# EAGLE design 16ch_omn_hirose_adapter (EAGLE 7.2.0)
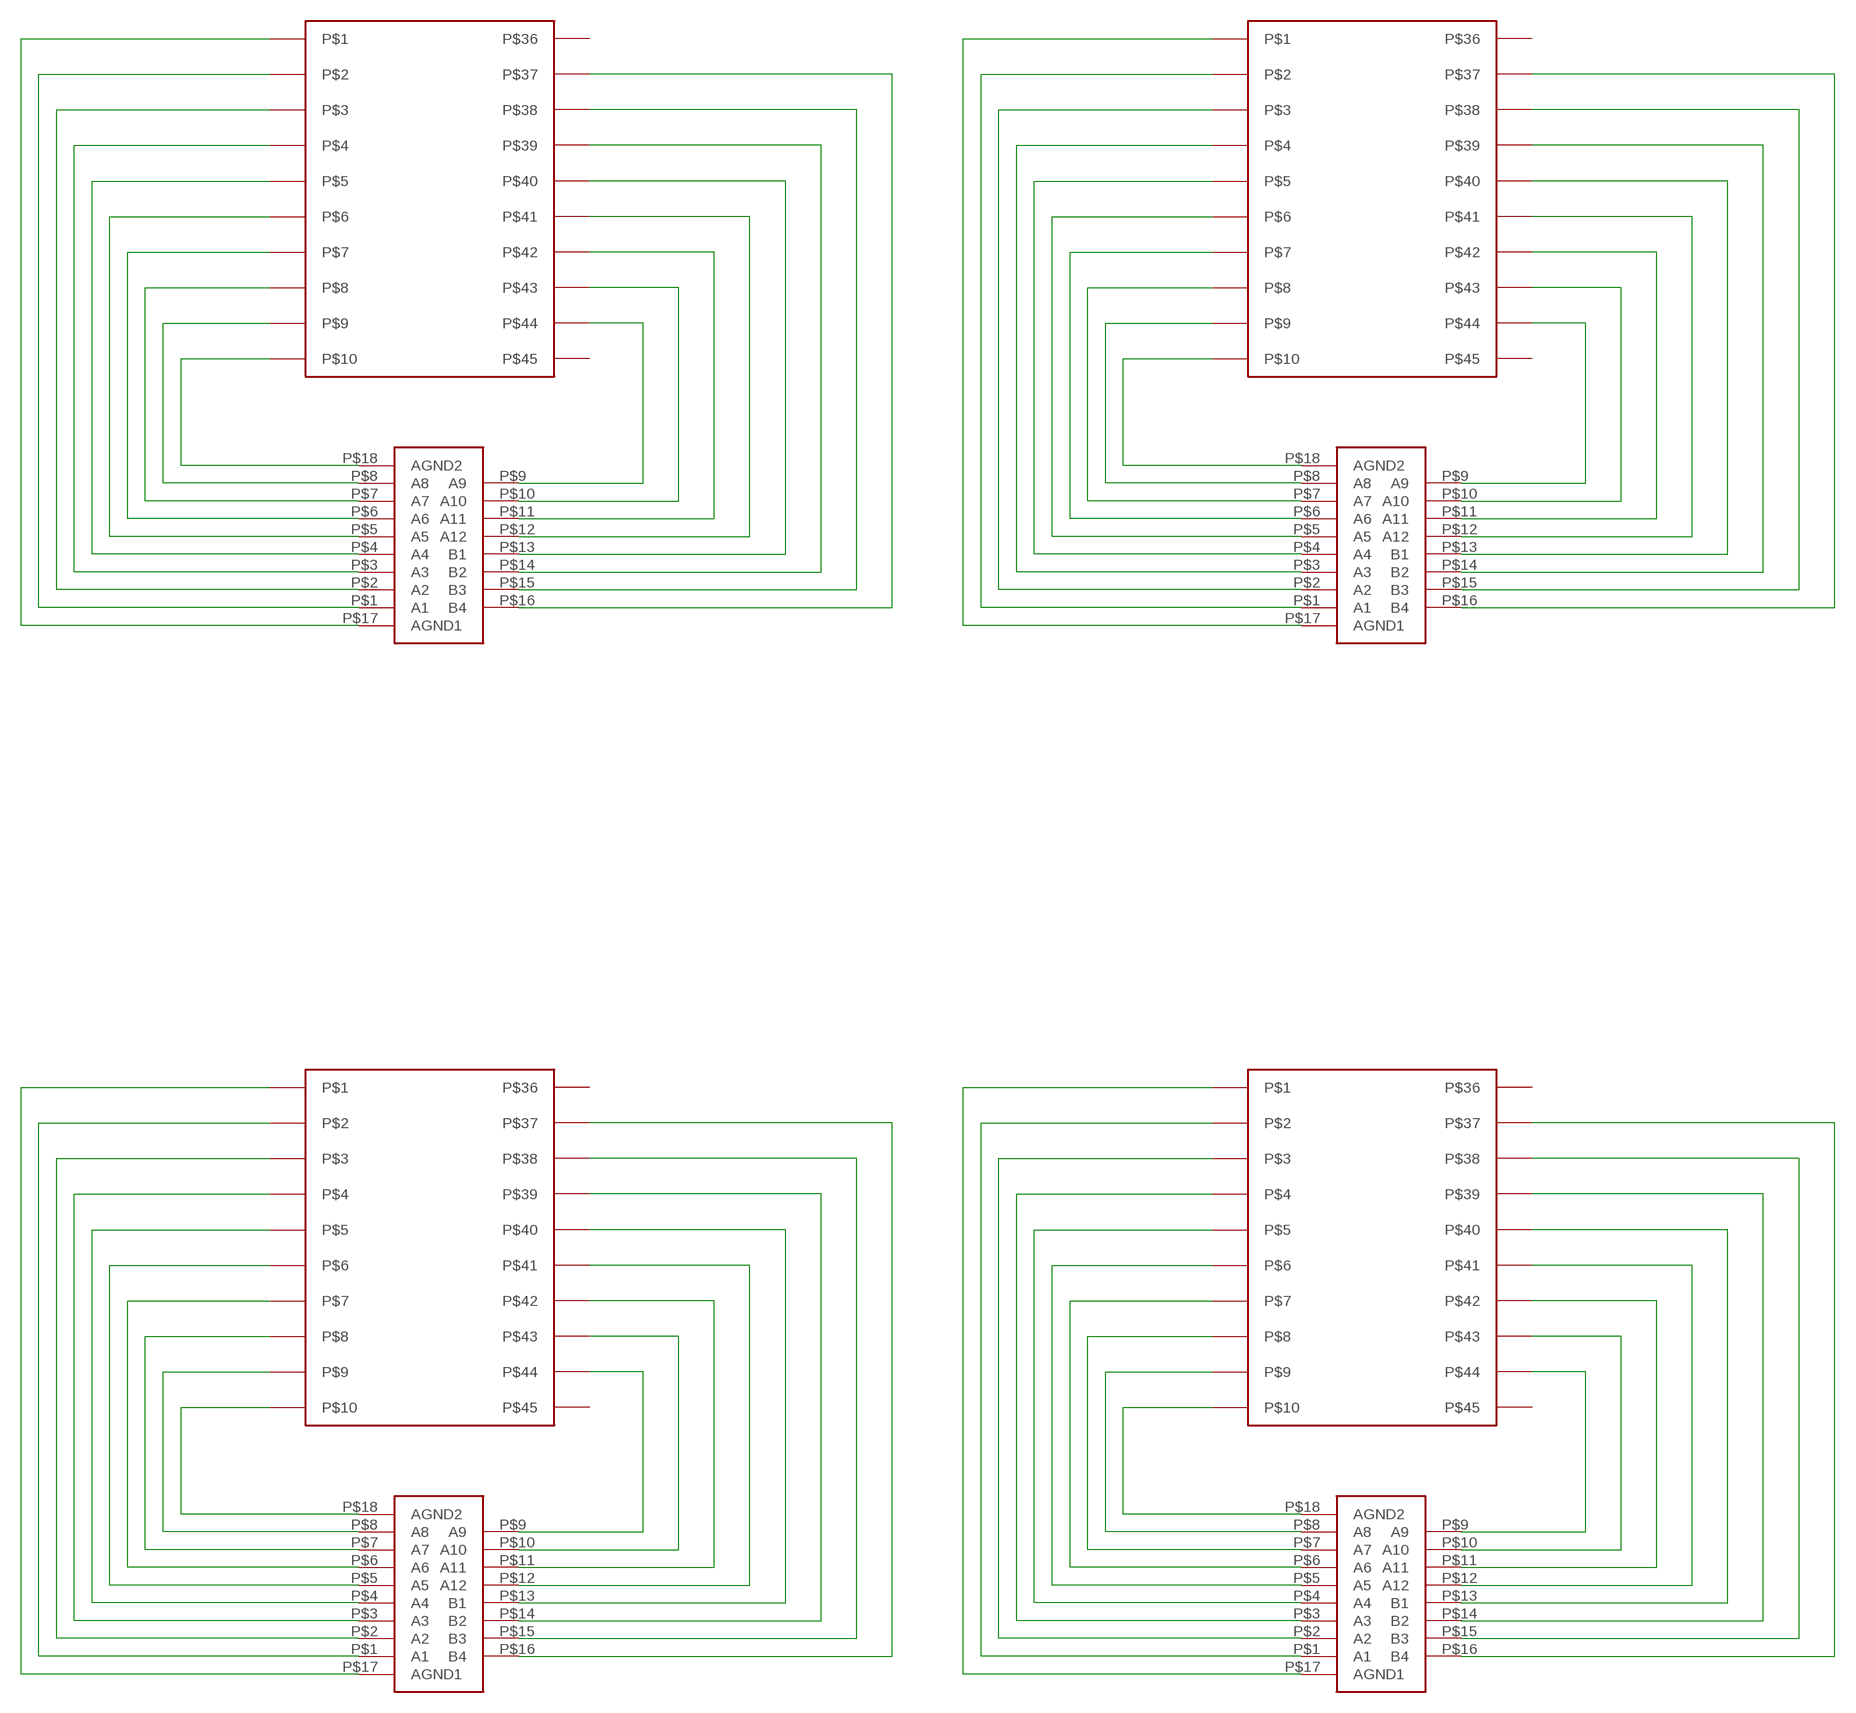
[diagram p0: schematic, sheet 1]

## Parts
U$1  HIROSE_DF40_70PIN  [HIROSE_DF40C-70DS]
U$2  OMNETICS_FE18  [OMNETICS_FE18]
U$3  HIROSE_DF40_70PIN  [HIROSE_DF40C-70DS]
U$4  OMNETICS_FE18  [OMNETICS_FE18]
U$5  HIROSE_DF40_70PIN  [HIROSE_DF40C-70DS]
U$6  OMNETICS_FE18  [OMNETICS_FE18]
U$7  HIROSE_DF40_70PIN  [HIROSE_DF40C-70DS]
U$8  OMNETICS_FE18  [OMNETICS_FE18]

## Nets
N$1: U$1.P$10 U$2.P$18(AGND2)
N$2: U$1.P$9 U$2.P$8(A8)
N$3: U$1.P$8 U$2.P$7(A7)
N$4: U$1.P$7 U$2.P$6(A6)
N$5: U$1.P$6 U$2.P$5(A5)
N$6: U$1.P$5 U$2.P$4(A4)
N$7: U$1.P$4 U$2.P$3(A3)
N$8: U$1.P$3 U$2.P$2(A2)
N$9: U$1.P$2 U$2.P$1(A1)
N$10: U$1.P$1 U$2.P$17(AGND1)
N$11: U$1.P$44 U$2.P$9(A9)
N$12: U$1.P$43 U$2.P$10(A10)
N$13: U$1.P$42 U$2.P$11(A11)
N$14: U$1.P$41 U$2.P$12(A12)
N$15: U$1.P$40 U$2.P$13(B1)
N$16: U$1.P$39 U$2.P$14(B2)
N$17: U$1.P$38 U$2.P$15(B3)
N$18: U$1.P$37 U$2.P$16(B4)
N$19: U$3.P$10 U$4.P$18(AGND2)
N$20: U$3.P$9 U$4.P$8(A8)
N$21: U$3.P$8 U$4.P$7(A7)
N$22: U$3.P$7 U$4.P$6(A6)
N$23: U$3.P$6 U$4.P$5(A5)
N$24: U$3.P$5 U$4.P$4(A4)
N$25: U$3.P$4 U$4.P$3(A3)
N$26: U$3.P$3 U$4.P$2(A2)
N$27: U$3.P$2 U$4.P$1(A1)
N$28: U$3.P$1 U$4.P$17(AGND1)
N$29: U$3.P$44 U$4.P$9(A9)
N$30: U$3.P$43 U$4.P$10(A10)
N$31: U$3.P$42 U$4.P$11(A11)
N$32: U$3.P$41 U$4.P$12(A12)
N$33: U$3.P$40 U$4.P$13(B1)
N$34: U$3.P$39 U$4.P$14(B2)
N$35: U$3.P$38 U$4.P$15(B3)
N$36: U$3.P$37 U$4.P$16(B4)
N$37: U$5.P$10 U$6.P$18(AGND2)
N$38: U$5.P$9 U$6.P$8(A8)
N$39: U$5.P$8 U$6.P$7(A7)
N$40: U$5.P$7 U$6.P$6(A6)
N$41: U$5.P$6 U$6.P$5(A5)
N$42: U$5.P$5 U$6.P$4(A4)
N$43: U$5.P$4 U$6.P$3(A3)
N$44: U$5.P$3 U$6.P$2(A2)
N$45: U$5.P$2 U$6.P$1(A1)
N$46: U$5.P$1 U$6.P$17(AGND1)
N$47: U$5.P$44 U$6.P$9(A9)
N$48: U$5.P$43 U$6.P$10(A10)
N$49: U$5.P$42 U$6.P$11(A11)
N$50: U$5.P$41 U$6.P$12(A12)
N$51: U$5.P$40 U$6.P$13(B1)
N$52: U$5.P$39 U$6.P$14(B2)
N$53: U$5.P$38 U$6.P$15(B3)
N$54: U$5.P$37 U$6.P$16(B4)
N$55: U$7.P$10 U$8.P$18(AGND2)
N$56: U$7.P$9 U$8.P$8(A8)
N$57: U$7.P$8 U$8.P$7(A7)
N$58: U$7.P$7 U$8.P$6(A6)
N$59: U$7.P$6 U$8.P$5(A5)
N$60: U$7.P$5 U$8.P$4(A4)
N$61: U$7.P$4 U$8.P$3(A3)
N$62: U$7.P$3 U$8.P$2(A2)
N$63: U$7.P$2 U$8.P$1(A1)
N$64: U$7.P$1 U$8.P$17(AGND1)
N$65: U$7.P$44 U$8.P$9(A9)
N$66: U$7.P$43 U$8.P$10(A10)
N$67: U$7.P$42 U$8.P$11(A11)
N$68: U$7.P$41 U$8.P$12(A12)
N$69: U$7.P$40 U$8.P$13(B1)
N$70: U$7.P$39 U$8.P$14(B2)
N$71: U$7.P$38 U$8.P$15(B3)
N$72: U$7.P$37 U$8.P$16(B4)
Unconnected: U$1.P$36 U$1.P$45 U$3.P$36 U$3.P$45 U$5.P$36 U$5.P$45 U$7.P$36 U$7.P$45

## Library data of the parts
U$1 U$3 U$5 U$7 = GG_hirose20:HIROSE_DF40_70PIN
U$2 U$4 U$6 U$8 = connectors:OMNETICS_FE18

## Board
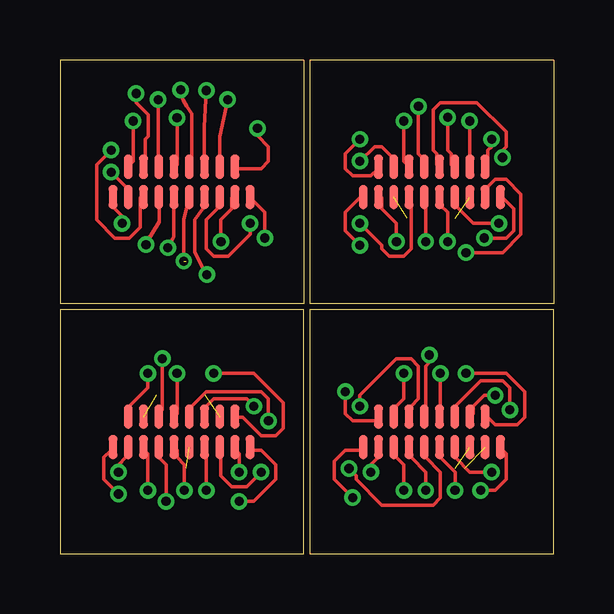
[diagram p1: board, top side]
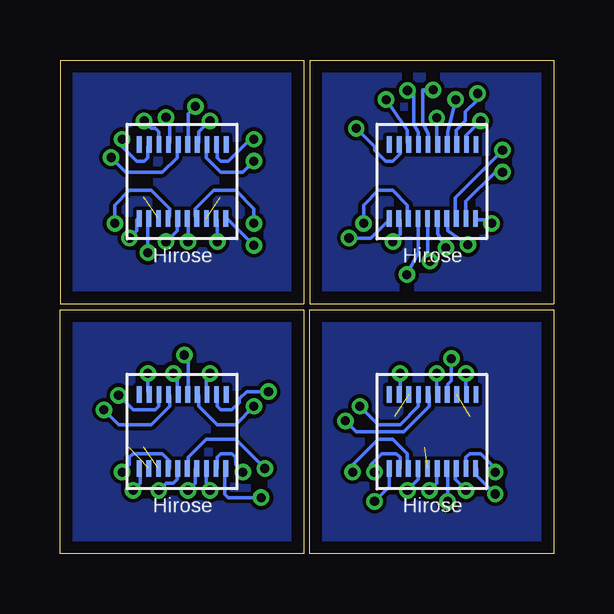
[diagram p2: board, bottom side, seen from below]

Size 20.57 x 20.57 mm. Coordinates in mm from the lower left corner, seen from the top.
Outline: 0,0 10.16,0 10.16,10.16 0,10.16 0,0
Outline: 10.41,10.16 10.41,0 20.57,0 20.57,10.16 10.41,10.16
Outline: 10.16,10.41 0,10.41 0,20.57 10.16,20.57 10.16,10.41
Outline: 10.41,20.57 10.41,10.41 20.57,10.41 20.57,20.57 10.41,20.57
Copper layers (1*16): Top 0.035mm / dielectric 1.5mm / Bottom 0.035mm
Design rules "4pcb_33_gg *": minimum track width 6mil, minimum drill 15mil, track to track 6mil, track to pad 6mil, pad to pad 6mil, via to via 6mil, smd to smd 6mil, copper to edge 20mil, drill to drill 6mil, minimum pad ring 6mil, minimum via ring 6mil, stop-mask expansion 4mil, vias tented up to drill 0mil, thermal gap 10mil

### Footprints (pad centres in the part's own frame; a part is rotated, then mirrored left to right if it is on the bottom)
HIROSE_DF40C-70DS = smd 0.2 x 0.7: P$1 0,0; P$2 -0.4,0; P$3 -0.8,0; P$4 -1.2,0; P$5 -1.6,0; P$6 -2,0; P$7 -2.4,0; P$8 -2.8,0; P$9 -3.2,0; P$10 -3.6,0; P$36 0,-3.08; P$37 -0.42,-3.08; P$38 -0.82,-3.08; P$39 -1.22,-3.08; P$40 -1.62,-3.08; P$41 -2.02,-3.08; P$42 -2.42,-3.08; P$43 -2.82,-3.08; P$44 -3.22,-3.08; P$45 -3.62,-3.08
OMNETICS_FE18 = smd 0.381 x 1.016: P$1 -1.905,0.635; P$2 -1.27,0.635; P$3 -0.635,0.635; P$4 0,0.635; P$5 0.635,0.635; P$6 1.27,0.635; P$7 1.905,0.635; P$8 2.54,0.635; P$9 2.54,-0.635; P$10 1.905,-0.635; P$11 1.27,-0.635; P$12 0.635,-0.635; P$13 0,-0.635; P$14 -0.635,-0.635; P$15 -1.27,-0.635; P$16 -1.905,-0.635; P$17 -2.54,0.635; P$18 3.175,0.635

### Placement (x,y rotation side)
U$1  6.86,3.56 180 bottom
U$2  5.38,5.08 180 top
U$3  17.27,3.56 180 bottom
U$4  15.81,5.08 180 top
U$5  17.27,13.97 180 bottom
U$6  15.81,15.49 180 top
U$7  6.86,13.97 180 bottom
U$8  5.38,15.49 180 top

### Tracks (layer width: path | path; a pad name or v marks a point on that pad's centre or on a via)
N$1  (via drill 0.38)
  Top 0.152: v2.44,2.49 1.83,3.1 1.83,4.01 2.13,4.32 U$2.P$18
  Bottom 0.152: v2.44,2.49 3.2,3.25 3.2,3.56 U$1.P$10
N$2  (via drill 0.38)
  Top 0.152: v2.44,3.4 2.44,3.71 2.74,4.01 2.74,4.32 U$2.P$8
  Bottom 0.152: U$1.P$9 3.66,4.01 3.51,4.17 3.05,4.17 2.44,3.56 v2.44,3.4 | U$1.P$9
N$3  (via drill 0.38)
  Top 0.152: v3.66,2.64 3.66,4.17 3.51,4.32 U$2.P$7
  Bottom 0.152: v3.66,2.64 4.12,3.1 4.12,3.56 U$1.P$8
N$4  (via drill 0.38)
  Top 0.152: v4.42,2.18 4.42,3.71 4.12,4.01 U$2.P$6
  Bottom 0.152: v4.42,2.18 4.42,3.56 U$1.P$7
N$5  (via drill 0.38)
  Top 0.152: v5.18,2.64 5.18,3.71 4.88,4.01 4.88,4.32 U$2.P$5
  Bottom 0.152: v5.18,2.64 4.88,2.95 4.88,3.56 U$1.P$6
N$6  (1 unrouted)
N$7  (via drill 0.38)
  Top 0.152: v6.1,2.64 6.1,4.32 U$2.P$3
  Bottom 0.152: v6.1,2.64 5.64,3.1 5.64,3.56 U$1.P$4
N$8  (via drill 0.38)
  Top 0.152: v8.38,3.4 7.77,2.79 7.16,2.79 6.71,3.25 6.71,4.32 U$2.P$2
  Bottom 0.152: v8.38,3.4 8.38,3.71 7.32,4.77 6.71,4.77 6.1,4.17 6.1,3.56 U$1.P$3
N$9  (via drill 0.38)
  Top 0.152: v7.47,3.4 7.47,4.17 7.32,4.32 U$2.P$1
  Bottom 0.152: v7.47,3.4 7.62,3.56 7.62,3.71 7.16,4.17 6.55,4.17 6.4,4.01 6.4,3.56 U$1.P$2
N$10  (via drill 0.38)
  Top 0.152: v7.47,2.18 8.08,2.18 8.99,3.1 8.99,3.71 8.38,4.32 7.93,4.32 U$2.P$17
  Bottom 0.152: U$1.P$1 6.86,2.79 v7.47,2.18
N$11  (via drill 0.38)
  Top 0.152: v3.66,7.52 3.66,6.91 2.9,6.15 2.9,5.84 U$2.P$9
  Bottom 0.152: v3.66,7.52 3.66,6.76 U$1.P$44
N$12  (1 unrouted)
N$13  (via drill 0.38)
  Top 0.152: v4.27,8.13 4.27,5.99 4.12,5.84 U$2.P$11
  Bottom 0.152: v4.27,8.13 4.27,7.21 4.42,7.06 4.42,6.76 U$1.P$42
N$14  (via drill 0.38)
  Top 0.152: v4.88,7.52 4.88,5.84 U$2.P$12
  Bottom 0.152: v4.88,7.52 4.88,6.76 U$1.P$41
N$15  (via drill 0.38)
  Top 0.152: v8.69,5.54 8.69,6.45 8.38,6.76 6.1,6.76 5.49,6.15 5.49,5.84 U$2.P$13
  Bottom 0.152: v8.69,5.54 8.23,5.08 6.25,5.08 5.18,6.15 5.18,6.6 U$1.P$40
N$16  (via drill 0.38)
  Top 0.152: v8.08,6.15 7.77,6.45 6.4,6.45 6.1,6.15 6.1,5.84 U$2.P$14
  Bottom 0.152: v8.08,6.15 7.32,5.38 6.4,5.38 5.64,6.15 5.64,6.6 U$1.P$39
N$17  (1 unrouted)
N$18  (via drill 0.38)
  Top 0.152: v6.4,7.52 8.08,7.52 9.3,6.3 9.3,5.23 8.99,4.93 8.38,4.93 7.62,5.69 7.32,5.69 U$2.P$16
  Bottom 0.152: v6.4,7.52 6.4,6.76 U$1.P$37
N$19  (via drill 0.38)
  Top 0.152: v12.19,2.34 11.43,3.1 11.43,3.86 11.89,4.32 12.5,4.32 U$4.P$18
  Bottom 0.152: v12.19,2.34 13.56,2.34 13.72,2.49 13.72,3.56 U$3.P$10
N$20  (via drill 0.38)
  Top 0.152: v12.95,3.4 12.95,3.71 13.26,4.01 13.26,4.32 U$4.P$8
  Bottom 0.152: v12.95,3.4 13.26,3.71 13.26,4.01 13.41,4.17 13.87,4.17 14.02,4.01 14.02,3.56 U$3.P$9
N$21  (via drill 0.38)
  Top 0.152: v14.33,2.64 14.33,3.71 14.02,4.01 14.02,4.32 U$4.P$7
  Bottom 0.152: v14.33,2.64 14.48,2.79 U$3.P$8
N$22  (via drill 0.38)
  Top 0.152: v15.24,2.64 15.24,3.4 14.63,4.01 14.63,4.32 U$4.P$6
  Bottom 0.152: v15.24,2.64 14.94,2.95 14.94,3.56 U$3.P$7
N$23  (via drill 0.38)
  Top 0.152: v12.04,3.56 12.34,3.25 12.34,3.1 13.41,2.03 15.55,2.03 15.85,2.34 15.85,3.4 15.24,4.01 15.24,4.32 U$4.P$5
  Bottom 0.152: v12.04,3.56 13.26,4.77 14.48,4.77 15.24,4.01 15.24,3.56 U$3.P$6
N$24  (via drill 0.38)
  Top 0.152: v16.46,2.64 16.46,3.4 15.85,4.01 15.85,4.32 U$4.P$4
  Bottom 0.152: v16.46,2.64 16.15,2.95 15.85,2.95 15.7,3.1 15.7,3.56 U$3.P$5
N$25  (via drill 0.38)
  Top 0.152: v17.98,3.4 17.07,3.4 16.46,4.01 16.46,4.32 U$4.P$3
  Bottom 0.152: v17.98,3.4 17.68,3.71 17.68,4.01 17.53,4.17 16.31,4.17 16,3.86 16,3.56 U$3.P$4
N$26  (1 unrouted)
N$27  (1 unrouted)
N$28  (via drill 0.38)
  Top 0.152: v17.53,2.64 18.14,2.64 18.59,3.1 18.59,4.17 18.44,4.32 U$4.P$17
  Bottom 0.152: v17.53,2.64 17.22,2.95 17.22,3.56 U$3.P$1
N$29  (via drill 0.38)
  Top 0.152: v11.89,6.76 11.89,5.84 12.19,5.54 13.11,5.54 13.26,5.69 U$4.P$9
  Bottom 0.152: v11.89,6.76 12.8,6.76 13.11,6.45 13.11,6.3 13.41,5.99 13.87,5.99 14.02,6.15 14.02,6.6 U$3.P$44
N$30  (via drill 0.38)
  Top 0.152: v14.33,7.52 14.33,6.45 14.02,6.15 14.02,5.84 U$4.P$10
  Bottom 0.152: v14.33,7.52 14.48,7.37 14.48,6.76 U$3.P$43
N$31  (via drill 0.38)
  Top 0.152: v12.5,6.15 12.5,6.6 14.02,8.13 14.63,8.13 14.94,7.82 14.94,6.45 14.63,6.15 14.63,5.84 U$4.P$11
  Bottom 0.152: v12.5,6.15 13.26,5.38 14.02,5.38 14.78,6.15 14.78,6.6 U$3.P$42
N$32  (via drill 0.38)
  Top 0.152: v15.39,8.28 15.39,7.98 15.24,7.82 15.24,5.84 U$4.P$12
  Bottom 0.152: v15.39,8.28 15.24,8.13 15.24,6.76 U$3.P$41
N$33  (via drill 0.38)
  Top 0.152: v15.85,7.52 15.85,5.84 U$4.P$13
  Bottom 0.152: v15.85,7.52 15.7,7.37 15.7,6.76 U$3.P$40
N$34  (via drill 0.38)
  Top 0.152: v18.74,5.99 18.74,6.91 18.44,7.21 17.53,7.21 16.46,6.15 16.46,5.84 U$4.P$14
  Bottom 0.152: v18.74,5.99 18.14,5.38 16.76,5.38 16,6.15 16,6.6 U$3.P$39
N$35  (via drill 0.38)
  Top 0.152: v18.14,6.6 17.68,6.6 17.22,6.15 17.22,5.84 U$4.P$15
  Bottom 0.152: v18.14,6.6 17.53,5.99 16.61,5.99 16.46,6.15 16.46,6.6 U$3.P$38
N$36  (via drill 0.38)
  Top 0.152: v16.92,7.52 18.59,7.52 19.35,6.76 19.35,5.69 19.05,5.38 18.14,5.38 17.83,5.69 U$4.P$16
  Bottom 0.152: v16.92,7.52 16.92,6.76 U$3.P$37
N$37  (via drill 0.38)
  Top 0.152: v12.5,12.85 11.89,13.46 11.89,14.22 12.5,14.83 U$6.P$18
  Bottom 0.152: v12.5,12.85 13.72,14.07 U$5.P$10
N$38  (via drill 0.38)
  Top 0.152: v14.02,13 14.02,13.77 13.41,14.38 13.41,14.83 U$6.P$8
  Bottom 0.152: v14.02,13 14.02,13.92 U$5.P$9
N$39  (1 unrouted)
N$40  (via drill 0.38)
  Top 0.152: v12.5,13.77 13.41,12.85 13.41,12.7 13.72,12.39 14.33,12.39 14.63,12.7 14.63,14.83 U$6.P$6
  Bottom 0.152: v12.5,13.77 12.5,14.38 13.26,15.14 14.17,15.14 14.94,14.38 14.94,14.07 U$5.P$7
N$41  (via drill 0.38)
  Top 0.152: v15.24,13 15.24,14.83 U$6.P$5
  Bottom 0.152: v15.24,13 15.24,13.92 U$5.P$6
N$42  (via drill 0.38)
  Top 0.152: v16.15,13 16.15,14.22 15.85,14.53 15.85,14.83 U$6.P$4
  Bottom 0.152: v16.15,13 15.7,13.46 15.7,13.92 U$5.P$5
N$43  (via drill 0.38)
  Top 0.152: v18.29,13.77 17.22,13.77 16.46,14.53 16.46,14.83 U$6.P$3
  Bottom 0.152: v18.29,13.77 18.29,14.53 17.68,15.14 16.76,15.14 16,14.38 16,14.07 U$5.P$4
N$44  (1 unrouted)
N$45  (via drill 0.38)
  Top 0.152: v16.92,12.55 18.44,12.55 19.2,13.31 19.2,14.99 18.59,15.6 18.14,15.6 17.83,15.29 17.83,14.99 U$6.P$1
  Bottom 0.152: v16.92,12.55 16.92,13.92 U$5.P$2
N$46  (via drill 0.38)
  Top 0.152: v17.68,13.16 18.59,13.16 18.9,13.46 18.9,14.38 18.44,14.83 U$6.P$17
  Bottom 0.152: v17.68,13.16 17.37,13.46 17.37,13.92 17.22,14.07 U$5.P$1
N$47  (via drill 0.38)
  Top 0.152: v12.5,17.27 11.89,16.66 11.89,16.05 12.19,15.75 12.95,15.75 13.26,16.05 U$6.P$9
  Bottom 0.152: v12.5,17.27 12.65,17.27 13.56,16.36 13.87,16.36 14.02,16.51 14.02,16.97 U$5.P$44
N$48  (via drill 0.38)
  Top 0.152: v12.5,16.36 13.11,16.97 13.41,16.97 13.87,16.51 13.87,16.2 U$6.P$10
  Bottom 0.152: v12.5,16.36 12.95,15.9 13.87,15.9 14.48,16.51 14.48,16.97 U$5.P$43
N$49  (via drill 0.38)
  Top 0.152: v14.33,18.03 14.33,16.36 14.48,16.2 U$6.P$11
  Bottom 0.152: v14.33,18.03 14.78,17.58 14.78,17.12 U$5.P$42
N$50  (via drill 0.38)
  Top 0.152: v14.94,18.64 14.94,16.66 15.09,16.51 15.09,16.2 U$6.P$12
  Bottom 0.152: v14.94,18.64 15.24,18.34 15.24,17.12 U$5.P$41
N$51  (via drill 0.38)
  Top 0.152: v18.44,16.51 18.44,16.81 18.59,16.97 18.59,17.58 17.37,18.8 15.85,18.8 15.55,18.49 15.55,16.81 15.7,16.66 15.7,16.2 U$6.P$13
  Bottom 0.152: v18.44,16.51 17.83,15.9 16.31,15.9 15.7,16.51 15.7,16.97 U$5.P$40
N$52  (via drill 0.38)
  Top 0.152: v16.15,18.19 16.15,16.81 16.31,16.66 16.31,16.2 U$6.P$14
  Bottom 0.152: v16.15,18.19 16,18.03 16,17.12 U$5.P$39
N$53  (via drill 0.38)
  Top 0.152: v17.07,18.03 17.07,16.2 U$6.P$15
  Bottom 0.152: v17.07,18.03 16.76,17.73 16.61,17.73 16.46,17.58 16.46,17.12 U$5.P$38
N$54  (via drill 0.38)
  Top 0.152: v17.98,17.27 17.98,16.97 17.83,16.81 17.83,16.2 U$6.P$16
  Bottom 0.152: v17.98,17.27 17.98,16.97 17.37,16.36 17.07,16.36 16.92,16.51 16.92,16.97 U$5.P$37
N$55  (via drill 0.38)
  Top 0.152: v2.59,13.77 2.59,14.07 2.29,14.38 2.29,14.83 U$8.P$18
  Bottom 0.152: v2.59,13.77 2.74,13.92 3.2,13.92 U$7.P$10
N$56  (via drill 0.38)
  Top 0.152: v2.13,15.9 2.74,15.29 2.74,14.99 U$8.P$8
  Bottom 0.152: v2.13,15.9 2.44,15.9 3.66,14.68 3.66,14.07 U$7.P$9
N$57  (via drill 0.38)
  Top 0.152: v2.13,16.81 1.52,16.2 1.52,13.92 2.29,13.16 2.9,13.16 3.35,13.61 3.35,14.83 U$8.P$7
  Bottom 0.152: v2.13,16.81 4.12,14.83 4.12,14.07 U$7.P$8
N$58  (via drill 0.38)
  Top 0.152: v3.58,12.88 3.56,12.88 4.14,13.84 4.14,14.68 4.12,14.83 U$8.P$6
  Bottom 0.152: v3.58,12.88 4.42,13.46 4.42,13.92 U$7.P$7
N$59  (via drill 0.38)
  Top 0.152: U$8.P$5 4.75,13.21 4.7,13.13 v4.5,12.75
  Bottom 0.152: v4.5,12.75 4.83,13.34 4.83,13.92 4.88,13.92 U$7.P$6
N$60  (via drill 0.38 pad 0.41)  (1 unrouted)
  Top 0.152: U$8.P$4 5.16,13.92 v5.16,12.19
  Bottom 0.152: U$7.P$5 5.26,13.92 5.26,12.19
N$61  (via drill 0.38)
  Top 0.152: v6.12,11.63 6.1,11.63 5.61,12.57 5.61,13.92 5.94,14.38 5.94,14.83 U$8.P$3
  Bottom 0.152: v6.12,11.63 5.64,12.55 5.64,13.92 U$7.P$4
N$62  (via drill 0.38)
  Top 0.152: v7.93,13.77 7.93,13.31 7.01,12.39 6.4,12.39 6.1,12.7 6.1,13.92 6.55,14.38 6.55,14.83 U$8.P$2
  Bottom 0.152: v7.93,13.77 7.93,14.53 7.32,15.14 6.71,15.14 6.1,14.53 6.1,14.07 U$7.P$3
N$63  (via drill 0.38)
  Top 0.152: v6.71,13 6.71,13.92 7.16,14.38 7.16,14.83 U$8.P$1
  Bottom 0.152: v6.71,13 6.4,13.31 6.4,13.92 U$7.P$2
N$64  (via drill 0.38)
  Top 0.152: v8.53,13.16 8.53,14.22 7.93,14.83 U$8.P$17
  Bottom 0.152: v8.53,13.16 7.62,13.16 6.86,13.92 U$7.P$1
N$65  (via drill 0.38)
  Top 0.152: v3.05,18.03 3.05,16.36 2.9,16.2 U$8.P$9
  Bottom 0.152: v3.05,18.03 3.66,17.42 3.66,17.12 U$7.P$44
N$66  (via drill 0.38 pad 0.41)
  Top 0.152: U$8.P$10 3.56,16.2 3.56,17.27 3.68,17.4 3.68,18.29 3.18,18.8 v3.18,19.18
  Bottom 0.152: U$7.P$43 4.06,17.05 4.06,17.65 3.68,18.03 3.68,18.41 3.18,18.92 v3.18,19.18
N$67  (via drill 0.38)
  Top 0.152: v4.09,18.92 4.09,16.36 4.12,16.2 U$8.P$11
  Bottom 0.152: v4.09,18.92 4.42,17.58 4.42,17.12 U$7.P$42
N$68  (via drill 0.38)
  Top 0.152: v4.88,18.16 4.88,16.2 U$8.P$12
  Bottom 0.152: v4.88,18.16 4.88,17.12 U$7.P$41
N$69  (via drill 0.38 pad 0.41)
  Top 0.152: v5.03,19.33 5.03,19.13 5.13,18.9 5.28,18.64 5.49,18.34 5.49,16.2 U$8.P$13
  Bottom 0.152: v5.03,19.33 5.46,19.33 5.46,17.93 5.23,17.5 5.23,16.97 U$7.P$40
N$70  (via drill 0.38 pad 0.41)
  Top 0.152: U$8.P$14 6.02,17.78 v6.1,19.3
  Bottom 0.152: U$7.P$39 5.64,17.56 5.84,17.91 5.84,19.18 v6.1,19.3
N$71  (via drill 0.38)
  Top 0.152: v6.98,18.92 6.66,17.37 6.66,16.66 6.55,16.2 U$8.P$15
  Bottom 0.152: v6.98,18.92 6.1,17.65 6.1,17.12 U$7.P$38
N$72  (via drill 0.38)
  Top 0.152: v8.23,17.73 8.23,17.42 8.69,16.97 8.69,16.36 8.38,16.05 7.32,16.05 U$8.P$16
  Bottom 0.152: v8.23,17.73 7.47,16.97 7.47,16.81 7.01,16.36 6.71,16.36 6.4,16.66 6.4,16.97 U$7.P$37
N$73
  pour Bottom: 0,20.57 0,10.41 10.16,10.41 10.16,20.57
N$74
  pour Bottom: 10.41,20.57 10.41,10.41 20.57,10.41 20.57,20.57
N$75
  pour Bottom: 10.41,10.16 10.41,0 20.57,0 20.57,10.16
N$76
  pour Bottom: 0,10.16 0,0 10.16,0 10.16,10.16